# Altium schematic sheet Ampli_audio.SchDoc
size A4
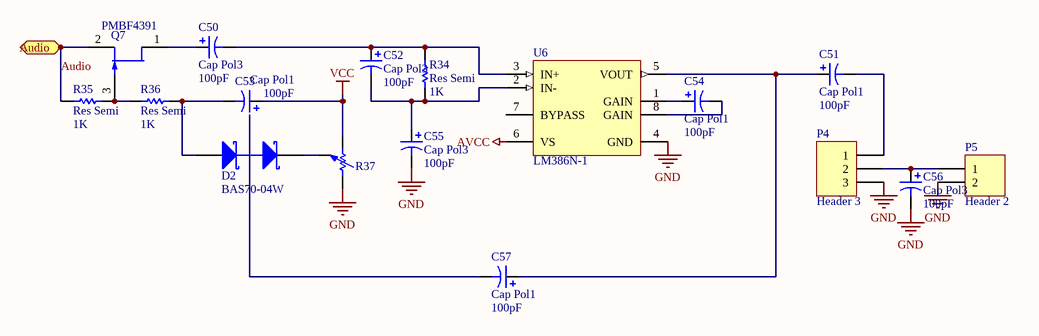
[diagram p0: Ampli_audio.SchDoc]

## Parts
C50  Cap Pol3  value 100pF  [C0805]
C51  Cap Pol1  value 100pF  [B]
C52  Cap Pol3  value 100pF  [C0805]
C53  Cap Pol1  value 100pF  [B]
C54  Cap Pol1  value 100pF  [B]
C55  Cap Pol3  value 100pF  [C0805]
C56  Cap Pol3  value 100pF  [C0805]
C57  Cap Pol1  value 100pF  [B]
D2  BAS70-04W  [SOT323_N]
P4  Header 3  [HDR1X3]
P5  Header 2  [HDR1X2]
Q7  PMBF4391  [SOT23_N]
R34  Res Semi  value 1K  [2012[0805]]
R35  Res Semi  value 1K  [2012[0805]]
R36  Res Semi  value 1K  [2012[0805]]
R37  Pot  [Potenciometro]  (value not drawn)
U6  LM386N-1  [N08E]

## Ports
Audio (in)

## Nets
AVCC: U6.6(VS)
GND: C55.2 C56.2 P4.3 P5.2 R37.1 U6.4(GND)
VCC: C53.1 R37.2
Audio: Q7.2(S) R35.1 ; port Audio
NetC50_1: C50.1 Q7.1(D)
NetC50_2: C50.2 C52.1 R34.2 U6.3(IN+)
NetC51_1: C51.1 C57.1 U6.5(VOUT)
NetC51_2: C51.2 P4.1
NetC52_2: C52.2 C55.1 R34.1 U6.2(IN-)
NetC53_2: C53.2 D2.1(A) R36.2
NetC54_1: C54.1 U6.1(GAIN)
NetC54_2: C54.2 U6.8(GAIN)
NetC56_1: C56.1 P4.2 P5.1
NetC57_2: C57.2 D2.3(C)
NetD2_2: D2.2(K) R37.3
NetQ7_3: Q7.3(G) R35.2 R36.1

Not connected (* = marked no-connect by the designer): U6 7(BYPASS)

## Library data of the parts
C50 C52 C55 C56 = Cap Pol3: Polarized Capacitor (Surface Mount); Published: 8-Jun-2000; LatestRevisionDate: 17-Jul-2002; LatestRevisionNote: Re-released for DXP Platform.; PackageReference: C0805; Publisher: Altium Limited
C51 C53 C54 C57 = Cap Pol1: Polarized Capacitor (Radial); Published: 8-Jun-2000; LatestRevisionDate: 17-Jul-2002; LatestRevisionNote: Re-released for DXP Platform.; PackageReference: RB7.6-15; Publisher: Altium Limited
D2 = BAS70-04W: Schottky Barrier Double Diode; Published: 17-Sep-2003; LatestRevisionDate: 12-Dec-2006; LatestRevisionNote: IPC-7351 Footprint Added.; DatasheetVersion: 26-Mar-1999; PackageVersion: Apr-1999; PackageReference: SOT323; Publisher: Altium Limited; PackageDescription: 3-Pin SOT-323 Package 0.65 mm Pitch, 2.1 mm Lead Span; ComponentLink1Description: Manufacturer Link; ComponentLink1URL: http://www.semiconductors.philips.com/; ComponentLink2Description: Datasheet; ComponentLink2URL: http://www.semiconductors.philips.com/acrobat/datasheets/BAS70W_3.pdf
P4 = Header 3: Header, 3-Pin; LatestRevisionDate: 17-Jul-2002; LatestRevisionNote: Re-released for DXP Platform.; Publisher: Altium Limited
P5 = Header 2: Header, 2-Pin; LatestRevisionDate: 17-Jul-2002; LatestRevisionNote: Re-released for DXP Platform.; Publisher: Altium Limited
Q7 = PMBF4391: N-channel Silicon Junction Field-effect Transistor; Published: 17-Sep-2003; LatestRevisionDate: 12-Dec-2006; LatestRevisionNote: IPC-7351 Footprint Added.; DatasheetVersion: Apr-1995; PackageVersion: May-1999; PackageReference: SOT23; Publisher: Altium Limited; PackageDescription: 3-Pin SOT-23 Package 0.95 mm Pitch, 2.3 mm Lead Span; ComponentLink1Description: Manufacturer Link; ComponentLink1URL: http://www.semiconductors.philips.com/; ComponentLink2Description: Datasheet; ComponentLink2URL: http://www.semiconductors.philips.com/acrobat/datasheets/PMBF4391_4392_4393_CNV_2.pdf
R34-R36 = Res Semi: Semiconductor Resistor; Published: 8-Jun-2000; LatestRevisionDate: 17-Jul-2002; LatestRevisionNote: Re-released for DXP Platform.; PackageReference: AXIAL-0.5; Publisher: Altium Limited
U6 = LM386N-1: Low Voltage Audio Power Amplifier; Manufacturer: National Semiconductor; CompType: Audio IC; PackageTopMarking: NSUZXYTT*LM*386N-1; Published: 27-Nov-2008; DatasheetVersion: Aug-2000; PackageVersion: revG, May-2006; PackageReference: N08E; PackageDescription: MDIP, .365 x .250 x .130in, 8 Lead, .100in Pitch; PartNumber: LM386N-1; RoHS: O; PinCount: 8; DigiKeyPartNumber: LM386N-1-ND; Code_JEDEC: MS-001-BA; ComponentLink1Description: LM386 Datasheet; ComponentLink1URL: http://www.national.com/ds/LM/LM386.pdf; ComponentLink2Description: LM386 Web Page; ComponentLink2URL: http://www.national.com/pf/LM/LM386.html; ComponentLink3Description: N08E Package Page; ComponentLink3URL: http://www.national.com/packaging/folders/n08e.html